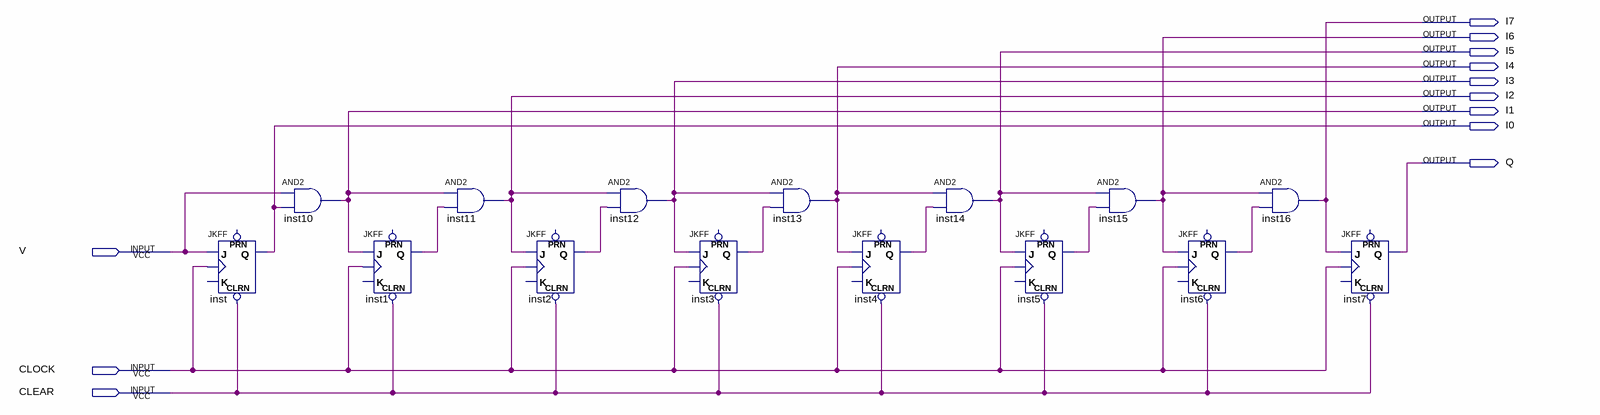
[diagram p0: schematic sheet]
// Quartus schematic 8b_syn_counter.bdf as structural Verilog: 15 symbols, 12 pins
module \8b_syn_counter  (
  input  V,
  input  CLOCK,
  input  CLEAR,
  output I7,
  output I6,
  output I5,
  output I4,
  output I3,
  output I2,
  output I1,
  output I0,
  output Q
);

  wire inst1_q, inst2_q, inst3_q, inst4_q, inst5_q, inst6_q;

  JKFF inst (.CLRN(CLEAR), .J(V), .CLK(CLOCK), .Q(I0));  // open: PRN, K
  and inst10 (I1, V, I0);
  JKFF inst1 (.CLRN(CLEAR), .J(I1), .CLK(CLOCK), .Q(inst1_q));  // open: PRN, K
  and inst11 (I2, I1, inst1_q);
  JKFF inst2 (.CLRN(CLEAR), .J(I2), .CLK(CLOCK), .Q(inst2_q));  // open: PRN, K
  and inst12 (I3, I2, inst2_q);
  JKFF inst3 (.CLRN(CLEAR), .J(I3), .CLK(CLOCK), .Q(inst3_q));  // open: PRN, K
  and inst13 (I4, I3, inst3_q);
  JKFF inst4 (.CLRN(CLEAR), .J(I4), .CLK(CLOCK), .Q(inst4_q));  // open: PRN, K
  and inst14 (I5, I4, inst4_q);
  JKFF inst5 (.CLRN(CLEAR), .J(I5), .CLK(CLOCK), .Q(inst5_q));  // open: PRN, K
  and inst15 (I6, I5, inst5_q);
  JKFF inst6 (.CLRN(CLEAR), .J(I6), .CLK(CLOCK), .Q(inst6_q));  // open: PRN, K
  and inst16 (I7, I6, inst6_q);
  JKFF inst7 (.CLRN(CLEAR), .J(I7), .CLK(CLOCK), .Q(Q));  // open: PRN, K
endmodule
